# EAGLE design Arduino-LED-Matrix-Shield_0.1 (EAGLE 5.11)
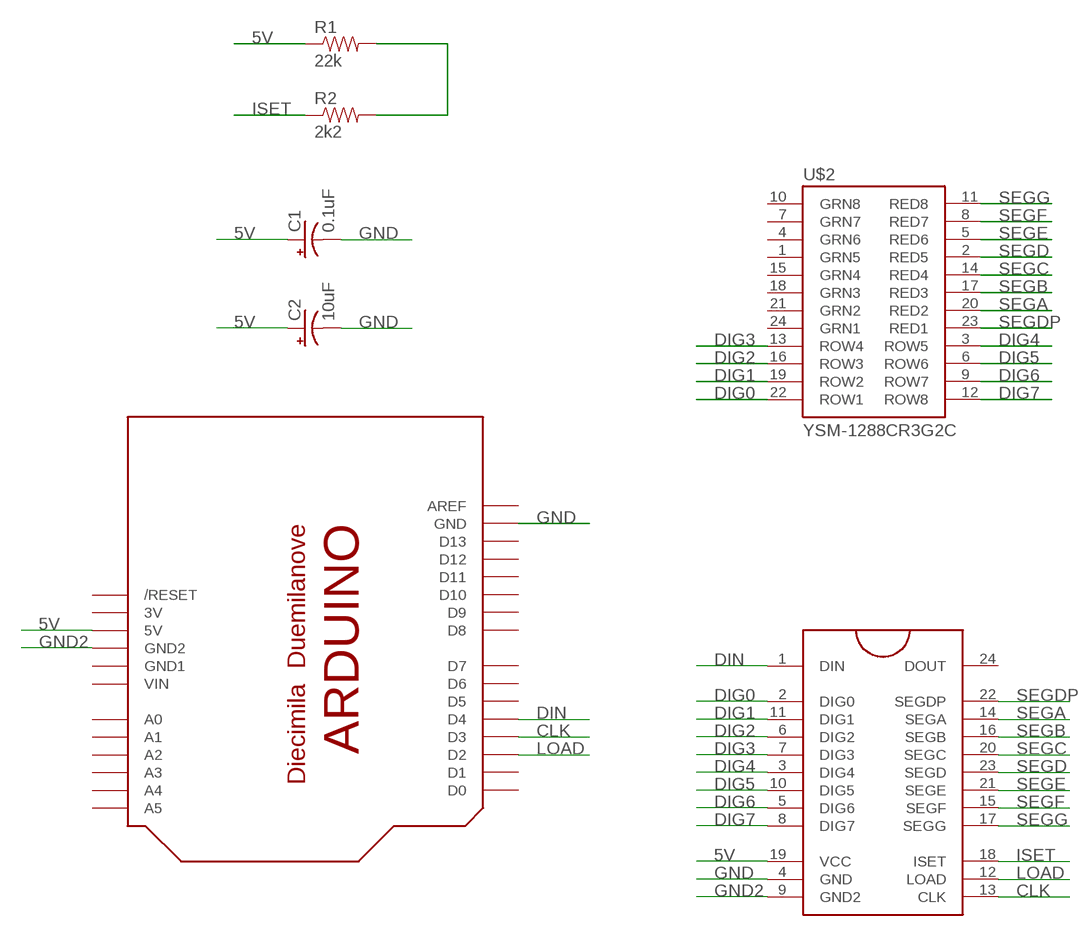
[diagram p0: schematic, sheet 1]

## Parts
C1  0.1uF  CAP_POLPTH2  [CPOL-RADIAL-10UF-25V]
C2  10uF  CAP_POLPTH2  [CPOL-RADIAL-10UF-25V]
R1  22k  RESISTORAXIAL-0.3  [AXIAL-0.3]
R2  2k2  RESISTORAXIAL-0.3  [AXIAL-0.3]
U$1  MAX7219DIP  [DIL24]
U$2  YSM-1288CR3G2C  [YSM-1288CR3G2C]
U$3  ARDUINOUNO  [ARDUINO]

## Nets
5V: C1.1(+) C2.1(+) R1.P$1 U$1.19(VCC) U$3.5V
CLK: U$1.13(CLK) U$3.D3
DIG0: U$1.2(DIG0) U$2.22(ROW1)
DIG1: U$1.11(DIG1) U$2.19(ROW2)
DIG2: U$1.6(DIG2) U$2.16(ROW3)
DIG3: U$1.7(DIG3) U$2.13(ROW4)
DIG4: U$1.3(DIG4) U$2.3(ROW5)
DIG5: U$1.10(DIG5) U$2.6(ROW6)
DIG6: U$1.5(DIG6) U$2.9(ROW7)
DIG7: U$1.8(DIG7) U$2.12(ROW8)
DIN: U$1.1(DIN) U$3.D4
GND: C1.2(-) C2.2(-) U$1.4(GND) U$3.GND
GND2: U$1.9(GND2) U$3.GND2
ISET: R2.P$1 U$1.18(ISET)
LOAD: U$1.12(LOAD) U$3.D2
N$2: R1.P$2 R2.P$2
SEGA: U$1.14(SEGA) U$2.20(RED2)
SEGB: U$1.16(SEGB) U$2.17(RED3)
SEGC: U$1.20(SEGC) U$2.14(RED4)
SEGD: U$1.23(SEGD) U$2.2(RED5)
SEGDP: U$1.22(SEGDP) U$2.23(RED1)
SEGE: U$1.21(SEGE) U$2.5(RED6)
SEGF: U$1.15(SEGF) U$2.8(RED7)
SEGG: U$1.17(SEGG) U$2.11(RED8)
Unconnected: U$1.24(DOUT) U$2.1(GRN5) U$2.4(GRN6) U$2.7(GRN7) U$2.10(GRN8) U$2.15(GRN4) U$2.18(GRN3) U$2.21(GRN2) U$2.24(GRN1) U$3.A0 U$3.A1 U$3.A2 U$3.A3 U$3.A4 U$3.A5 U$3.AREF U$3.D0 U$3.D1 U$3.D5 U$3.D6 U$3.D7 U$3.D8 U$3.D9 U$3.D10 U$3.D11 U$3.D12 U$3.D13 U$3.RESET(/RESET)

## Power pins joined to a net without a drawn wire
3V: U$3.3V
GND1: U$3.GND1
VIN: U$3.VIN

## Library data of the parts
C1 C2 = SparkFun:CAP_POL: Capacitor Polarized These are standard SMD and PTH capacitors. Normally 10uF, 47uF, and 100uF in electrolytic and tantalum varieties. Always verify the external diameter of the through hole cap, it varies with capacity, voltage, and manufacturer. The EIA devices should be standard.
R1 R2 = SparkFun:RESISTOR: Resistor Basic schematic elements and footprints for 0603, 1206, and PTH resistors.
U$1 = SparkFun:MAX7219
U$2 = led-matrix-v3:YSM-1288CR3G2C: LED Matrix - Dual Color (Red + Green) - Small sku: COM-00681 0.275 x 1.25 x 1.25"
U$3 = adafruit:ARDUINO: Arduino Diecimila/Duemilanove Make a shield with ease, this package has all the named pins as well as the two mounting drill holes and an outline of the USB and DC power connector. The outline is on the DIMENSION layer, so if your board house uses it they will cut the outline to match. http://www.ladyada.net/library/pcb/eaglelibrary.html

## Board
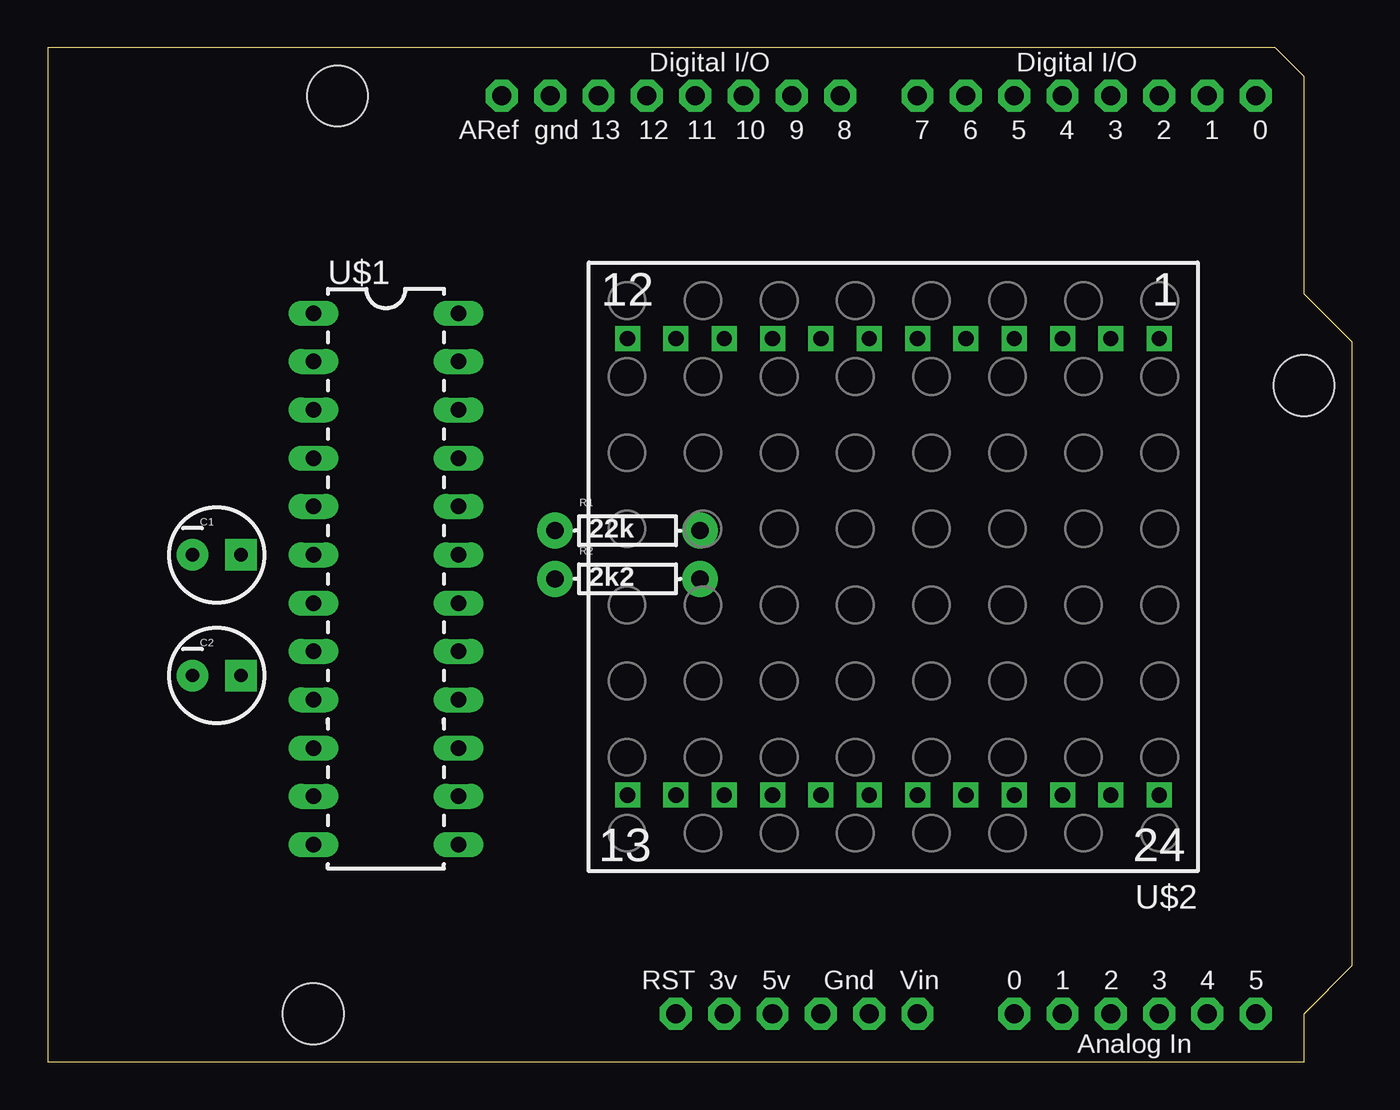
[diagram p1: board, top side]
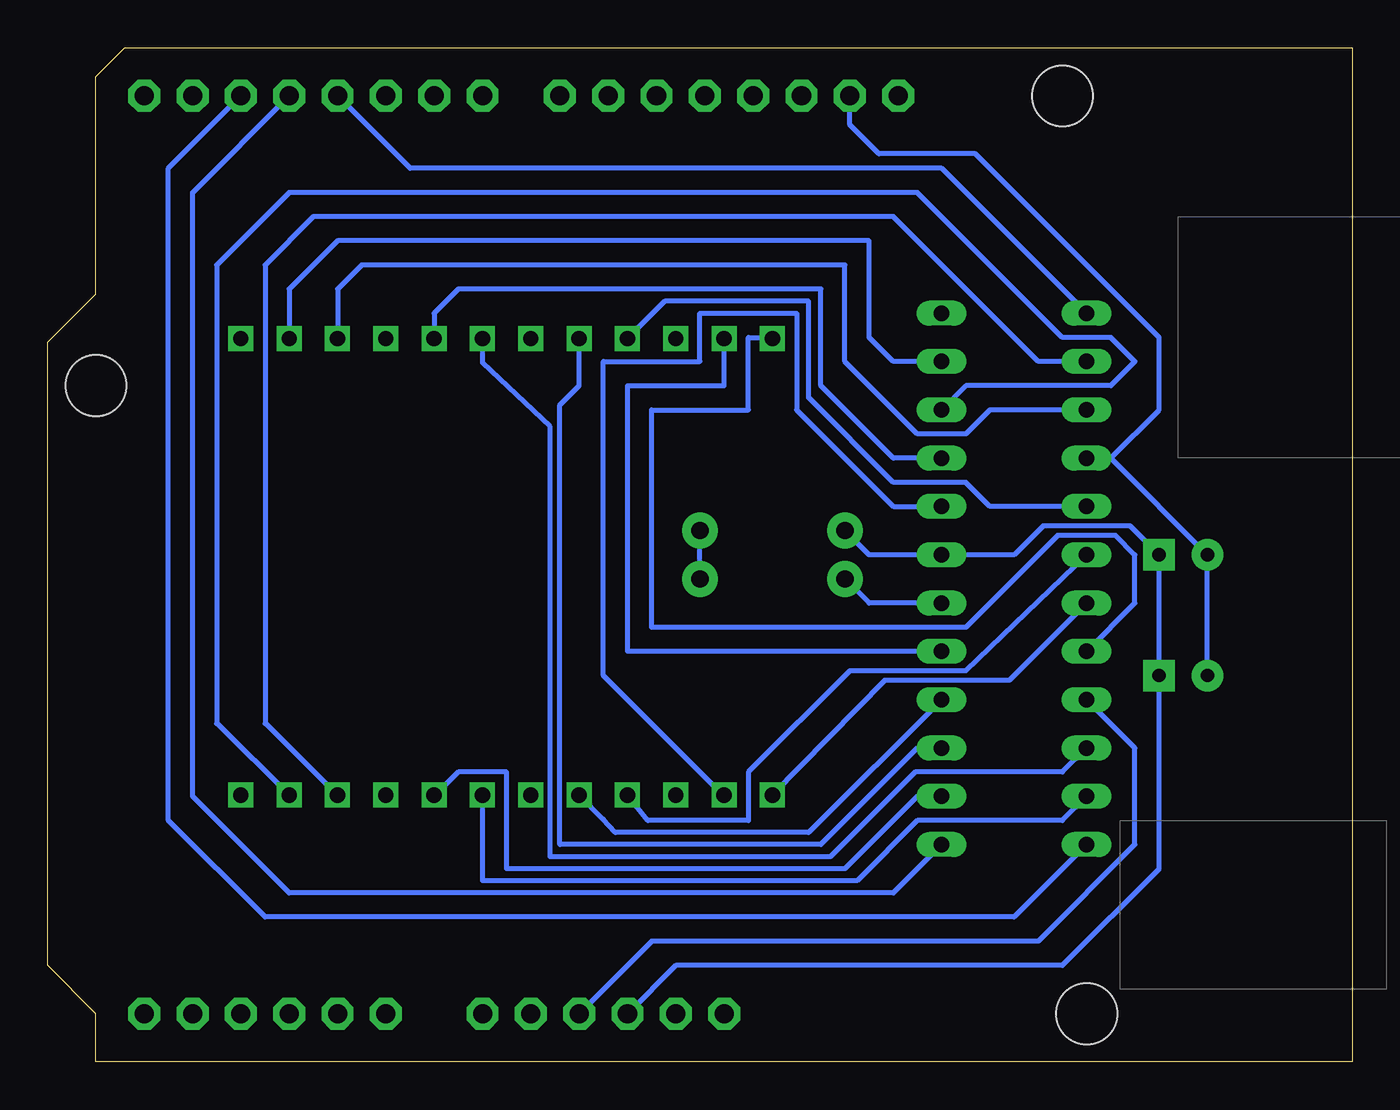
[diagram p2: board, bottom side, seen from below]

Size 68.58 x 53.34 mm. Coordinates in mm from the lower left corner, seen from the top.
Copper layers (1*16): Top 0.035mm / dielectric 1.5mm / Bottom 0.035mm
Design rules "default": minimum track width 10mil, minimum drill 24mil, track to track 8mil, track to pad 8mil, pad to pad 8mil, via to via 8mil, smd to smd 8mil, copper to edge 40mil, drill to drill 8mil, minimum pad ring 10mil, minimum via ring 8mil, stop-mask expansion 4mil, vias tented up to drill 0mil, thermal gap 10mil

### Footprints (pad centres in the part's own frame; a part is rotated, then mirrored left to right if it is on the bottom)
CPOL-RADIAL-10UF-25V = drill 0.7 pad 1.651 square: 1 1.27,0 | drill 0.7 pad 1.651 round: 2 -1.27,0
AXIAL-0.3 = drill 0.9 pad 1.88 round: P$1 -3.81,0; P$2 3.81,0
DIL24 = drill 0.813 long: 1 -13.97,-3.81; 2 -11.43,-3.81; 3 -8.89,-3.81; 4 -6.35,-3.81; 5 -3.81,-3.81; 6 -1.27,-3.81; 7 1.27,-3.81; 8 3.81,-3.81; 9 6.35,-3.81; 10 8.89,-3.81; 11 11.43,-3.81; 12 13.97,-3.81; 13 13.97,3.81; 14 11.43,3.81; 15 8.89,3.81; 16 6.35,3.81; 17 3.81,3.81; 18 1.27,3.81; 19 -1.27,3.81; 20 -3.81,3.81; 21 -6.35,3.81; 22 -8.89,3.81; 23 -11.43,3.81; 24 -13.97,3.81
YSM-1288CR3G2C = drill 0.8 square: 1 -13.975,-12; 2 -11.435,-12; 3 -8.895,-12; 4 -6.355,-12; 5 -3.815,-12; 6 -1.275,-12; 7 1.265,-12; 8 3.805,-12; 9 6.345,-12; 10 8.885,-12; 11 11.425,-12; 12 13.965,-12; 13 13.965,12; 14 11.425,12; 15 8.885,12; 16 6.345,12; 17 3.805,12; 18 1.265,12; 19 -1.275,12; 20 -3.815,12; 21 -6.355,12; 22 -8.895,12; 23 -11.435,12; 24 -13.975,12
ARDUINO = drill 1 pad 1.676 octagon: 3V 35.56,2.54; 5V 38.1,2.54; A0 50.8,2.54; A1 53.34,2.54; A2 55.88,2.54; A3 58.42,2.54; A4 60.96,2.54; A5 63.5,2.54; AREF 23.876,50.8; D0 63.5,50.8; D1 60.96,50.8; D2 58.42,50.8; D3 55.88,50.8; D4 53.34,50.8; D5 50.8,50.8; D6 48.26,50.8; D7 45.72,50.8; D8 41.656,50.8; D9 39.116,50.8; D10 36.576,50.8; D11 34.036,50.8; D12 31.496,50.8; D13 28.956,50.8; GND 26.416,50.8; GND1 43.18,2.54; GND2 40.64,2.54; RESET 33.02,2.54; VIN 45.72,2.54 | hole 3.2: 15.24,50.8; 66.04,35.56; 13.97,2.54

### Placement (x,y rotation side)
C1  8.89,26.67 0 top
C2  8.89,20.32 0 top
R1  30.48,27.94 0 top
R2  30.48,25.4 0 top
U$1  17.78,25.4 270 top
U$2  44.45,26.04 180 top
U$3  0,0 0 top

### Tracks (layer width: path | path; a pad name or v marks a point on that pad's centre or on a via)
5V
  Bottom 0.254: R1.P$1 25.4,26.67 U$1.19 17.78,26.67 16.26,28.19 11.68,28.19 C1.1 C2.1 10.16,10.16 15.24,5.08 35.56,5.08 U$3.5V
CLK
  Bottom 0.254: U$1.13 24.13,8.89 55.88,8.89 60.96,13.97 60.96,45.72 U$3.D3
DIG0
  Bottom 0.254: U$2.22 57.09,17.78 57.15,17.78 57.15,41.91 54.61,44.45 24.13,44.45 16.51,36.83 U$1.2
DIG1
  Bottom 0.254: U$1.11 15.24,12.7 22.86,12.7 26.04,9.53 45.72,9.53 U$2.19
DIG2
  Bottom 0.254: U$2.16 37.02,12.7 31.75,12.7 31.75,15.24 26.42,20.57 20.32,20.57 U$1.6
DIG3
  Bottom 0.254: U$2.13 24.58,20.07 18.03,20.07 U$1.7
DIG4
  Bottom 0.254: U$2.3 53.34,40.64 52.07,41.91 26.67,41.91 26.67,36.83 22.86,33.02 20.32,33.02 19.05,34.29 U$1.3
DIG5
  Bottom 0.254: U$2.6 45.72,36.76 42.16,33.4 42.16,10.79 27.43,10.79 22.99,15.24 15.24,15.24 U$1.10
DIG6
  Bottom 0.254: U$1.5 19.05,29.21 20.32,30.48 24.13,30.48 28.57,34.92 28.57,40.01 36.13,40.01 U$2.9
DIG7
  Bottom 0.254: U$1.8 11.43,24.13 11.43,26.67 12.45,27.69 15.49,27.69 20.32,22.86 36.83,22.86 36.83,34.29 31.75,34.29 31.75,38.1 30.55,38.1 U$2.12
DIN
  Bottom 0.254: U$3.D4 49.53,46.99 21.59,46.99 U$1.1
GND
  Bottom 0.254: U$3.GND 26.42,49.28 24.89,47.75 19.81,47.75 10.16,38.1 10.16,34.29 12.7,31.75 | C2.2 C1.2 12.7,31.75 | 12.7,31.75 U$1.4
GND2
  Bottom 0.254: U$1.9 11.43,16.51 11.43,11.43 16.51,6.35 36.83,6.35 U$3.GND2
ISET
  Bottom 0.254: U$1.18 25.4,24.13 R2.P$1
LOAD
  Bottom 0.254: U$3.D2 62.23,46.99 62.23,12.7 57.15,7.62 17.78,7.62 U$1.12
N$2
  Bottom 0.254: R2.P$2 R1.P$2
SEGA
  Bottom 0.254: U$2.20 48.2,14.04 46.99,15.24 44.45,15.24 44.45,10.16 26.67,10.16 22.86,13.97 U$1.14
SEGB
  Bottom 0.254: U$2.17 39.37,12.76 38.73,12.06 28.57,12.06 U$1.16
SEGC
  Bottom 0.254: U$1.20 24.13,29.21 29.21,34.29 29.21,39.37 34.29,39.37 34.29,36.83 39.37,36.83 39.37,20.32 33.09,14.04 U$2.14
SEGD
  Bottom 0.254: U$2.2 55.88,40.64 53.34,43.18 25.4,43.18 25.4,38.1 24.13,36.83 U$1.23
SEGDP
  Bottom 0.254: U$1.22 20.32,35.56 12.7,35.56 11.43,36.83 12.7,38.1 15.24,38.1 22.86,45.72 55.88,45.72 59.69,41.91 59.69,17.78 59.63,17.78 U$2.23
SEGE
  Bottom 0.254: U$2.5 48.26,39.37 46.99,40.64 27.94,40.64 27.94,35.56 24.13,31.75 U$1.21
SEGF
  Bottom 0.254: U$2.8 40.64,35.56 41.66,34.54 41.66,11.43 27.94,11.43 22.86,16.51 U$1.15
SEGG
  Bottom 0.254: U$2.11 33.02,35.56 38.1,35.56 38.1,21.59 U$1.17

### Text on the board
tNames: 12 | 1 | 13 | 24